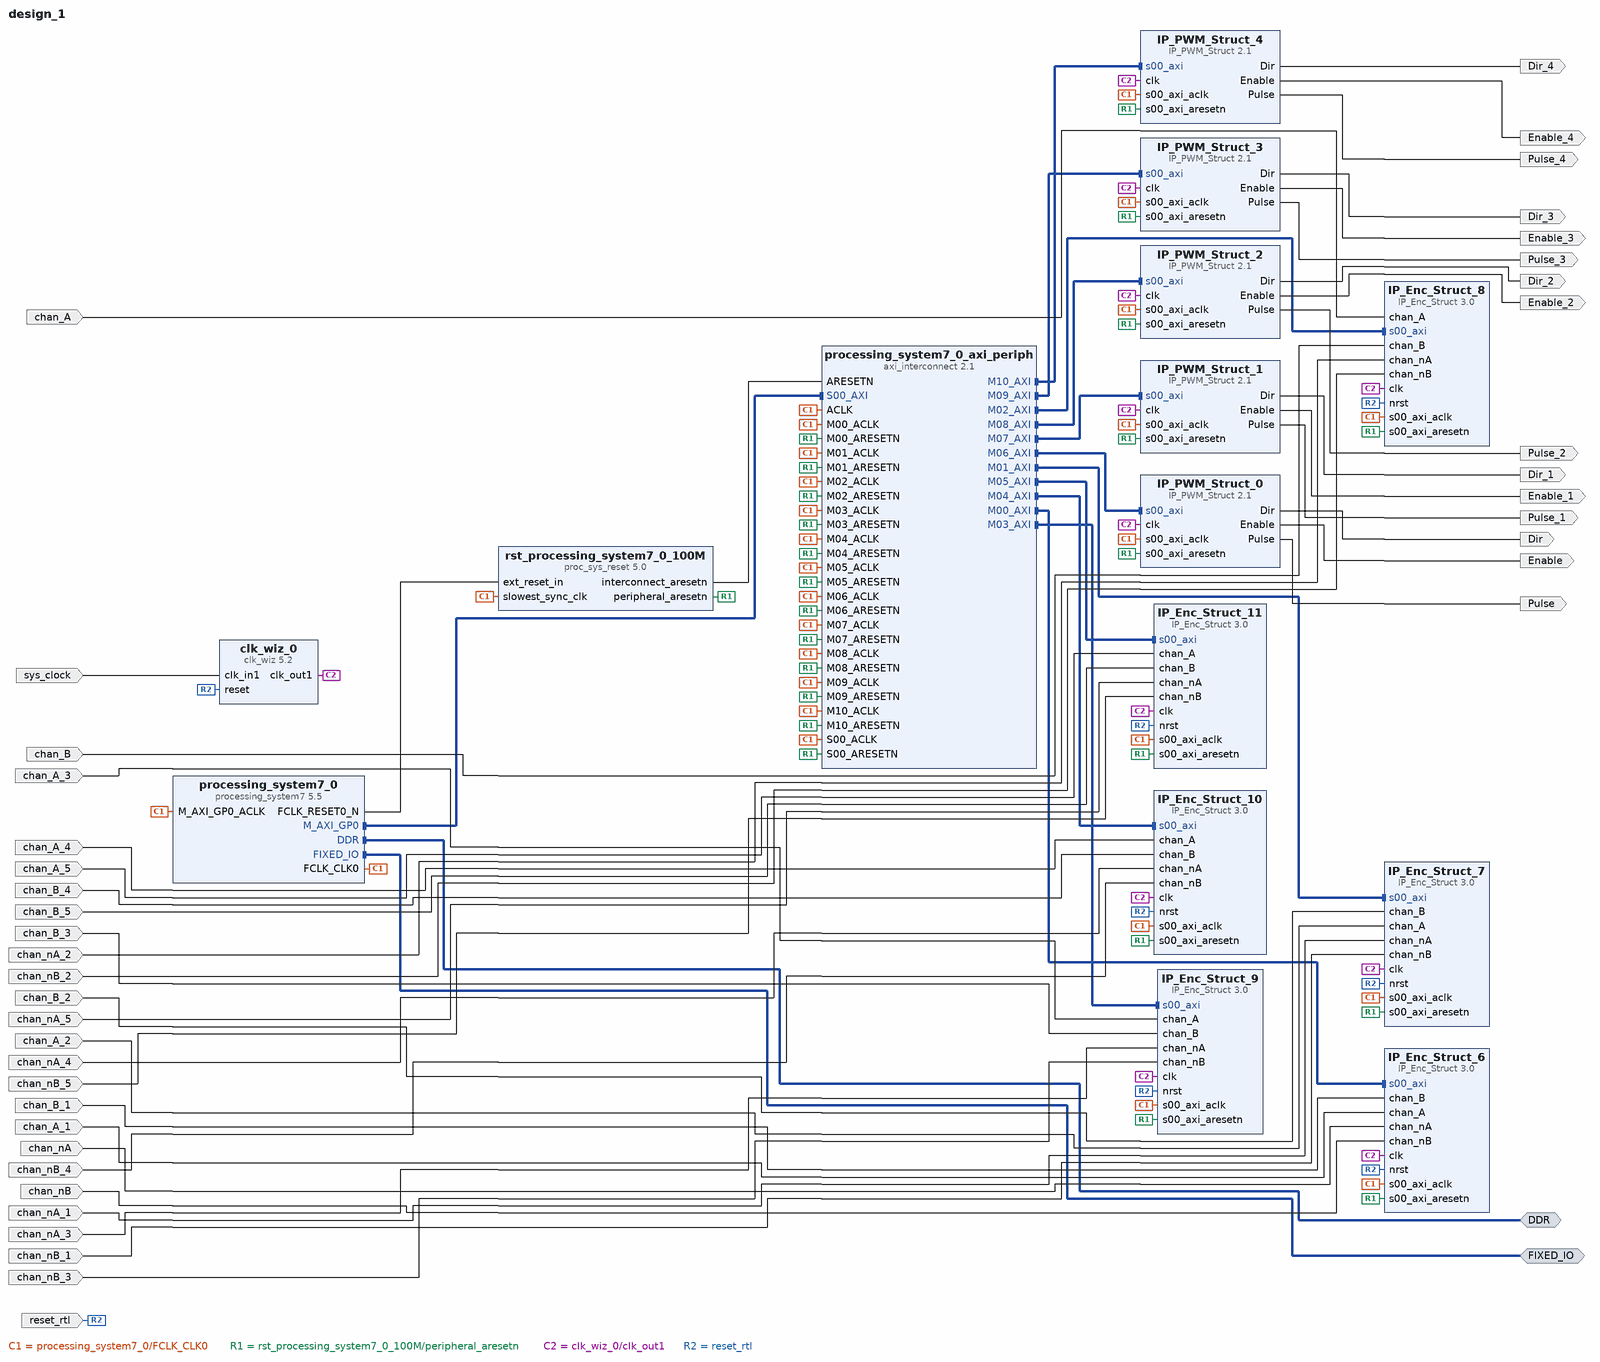
[diagram p0: block diagram of the top level]
# Vivado block design design_1, Vivado 2015.4
create_bd_design design_1

create_bd_intf_port -mode Master -vlnv xilinx.com:interface:ddrx_rtl:1.0 DDR
create_bd_intf_port -mode Master -vlnv xilinx.com:display_processing_system7:fixedio_rtl:1.0 FIXED_IO
create_bd_port -dir I -type clk sys_clock
set_property -dict {CONFIG.FREQ_HZ 125000000 CONFIG.PHASE 0.000} [get_bd_ports sys_clock]
create_bd_port -dir I -type rst reset_rtl
set_property -dict {CONFIG.POLARITY ACTIVE_HIGH} [get_bd_ports reset_rtl]
create_bd_port -dir I chan_A
create_bd_port -dir I chan_B
create_bd_port -dir I chan_A_3
create_bd_port -dir I chan_B_3
create_bd_port -dir I chan_B_2
create_bd_port -dir I chan_A_2
create_bd_port -dir I chan_B_1
create_bd_port -dir I chan_A_1
create_bd_port -dir I chan_A_4
create_bd_port -dir I chan_B_4
create_bd_port -dir I chan_A_5
create_bd_port -dir I chan_B_5
create_bd_port -dir O Pulse
create_bd_port -dir O Pulse_1
create_bd_port -dir O Pulse_2
create_bd_port -dir O Pulse_3
create_bd_port -dir O Pulse_4
create_bd_port -dir I chan_nA
create_bd_port -dir I chan_nB
create_bd_port -dir I chan_nA_1
create_bd_port -dir I chan_nB_1
create_bd_port -dir I chan_nA_2
create_bd_port -dir I chan_nB_2
create_bd_port -dir I chan_nA_3
create_bd_port -dir I chan_nB_3
create_bd_port -dir I chan_nA_4
create_bd_port -dir I chan_nB_4
create_bd_port -dir I chan_nA_5
create_bd_port -dir I chan_nB_5
create_bd_port -dir O Dir
create_bd_port -dir O Enable
create_bd_port -dir O Dir_1
create_bd_port -dir O Enable_1
create_bd_port -dir O Dir_2
create_bd_port -dir O Enable_2
create_bd_port -dir O Dir_3
create_bd_port -dir O Enable_3
create_bd_port -dir O Dir_4
create_bd_port -dir O Enable_4

create_bd_cell -type ip -vlnv xilinx.com:ip:processing_system7:5.5 processing_system7_0
set_property -dict [list \
  CONFIG.PCW_UIPARAM_DDR_FREQ_MHZ 525 \
  CONFIG.PCW_CRYSTAL_PERIPHERAL_FREQMHZ 50.000000 \
  CONFIG.PCW_APU_PERIPHERAL_FREQMHZ 650 \
  CONFIG.PCW_SDIO_PERIPHERAL_FREQMHZ 50 \
  CONFIG.PCW_FPGA0_PERIPHERAL_FREQMHZ 100 \
  CONFIG.PCW_FPGA1_PERIPHERAL_FREQMHZ 10 \
  CONFIG.PCW_PRESET_BANK1_VOLTAGE {LVCMOS 1.8V} \
  CONFIG.PCW_UIPARAM_DDR_PARTNO {MT41K128M16 JT-125} \
  CONFIG.PCW_QSPI_PERIPHERAL_ENABLE 1 \
  CONFIG.PCW_QSPI_GRP_SINGLE_SS_ENABLE 1 \
  CONFIG.PCW_QSPI_GRP_FBCLK_ENABLE 1 \
  CONFIG.PCW_ENET0_PERIPHERAL_ENABLE 1 \
  CONFIG.PCW_ENET0_ENET0_IO {MIO 16 .. 27} \
  CONFIG.PCW_ENET0_GRP_MDIO_ENABLE 1 \
  CONFIG.PCW_ENET0_RESET_ENABLE 0 \
  CONFIG.PCW_SD0_PERIPHERAL_ENABLE 1 \
  CONFIG.PCW_SD0_GRP_CD_ENABLE 1 \
  CONFIG.PCW_SD0_GRP_CD_IO {MIO 47} \
  CONFIG.PCW_SD0_GRP_WP_ENABLE 1 \
  CONFIG.PCW_UART1_PERIPHERAL_ENABLE 1 \
  CONFIG.PCW_SPI1_PERIPHERAL_ENABLE 1 \
  CONFIG.PCW_SPI1_SPI1_IO {MIO 10 .. 15} \
  CONFIG.PCW_SPI1_GRP_SS1_ENABLE 1 \
  CONFIG.PCW_SPI1_GRP_SS2_ENABLE 1 \
  CONFIG.PCW_TTC0_PERIPHERAL_ENABLE 1 \
  CONFIG.PCW_USB0_PERIPHERAL_ENABLE 1 \
  CONFIG.PCW_USB0_RESET_ENABLE 1 \
  CONFIG.PCW_USB0_RESET_IO {MIO 46} \
  CONFIG.PCW_GPIO_MIO_GPIO_ENABLE 1 \
] [get_bd_cells processing_system7_0]
# 108 more settings of processing_system7_0 are not shown: defaults, MIO pin electricals, DDR timing, and values the tool derives
create_bd_cell -type ip -vlnv xilinx.com:ip:axi_interconnect:2.1 processing_system7_0_axi_periph
set_property -dict {CONFIG.NUM_MI 11} [get_bd_cells processing_system7_0_axi_periph]
create_bd_cell -type ip -vlnv xilinx.com:ip:proc_sys_reset:5.0 rst_processing_system7_0_100M
create_bd_cell -type ip -vlnv xilinx.com:ip:clk_wiz:5.2 clk_wiz_0
set_property -dict [list \
  CONFIG.CLKOUT1_REQUESTED_OUT_FREQ 20.48 \
  CONFIG.MMCM_DIVCLK_DIVIDE 11 \
  CONFIG.MMCM_CLKFBOUT_MULT_F 60.375 \
  CONFIG.MMCM_CLKOUT0_DIVIDE_F 33.500 \
  CONFIG.USE_BOARD_FLOW true \
  CONFIG.CLK_IN1_BOARD_INTERFACE sys_clock \
  CONFIG.CLKOUT1_JITTER 638.166 \
  CONFIG.CLKOUT1_PHASE_ERROR 713.417 \
] [get_bd_cells clk_wiz_0]
create_bd_cell -type ip -vlnv xilinx.com:Fontys:IP_PWM_Struct:2.1 IP_PWM_Struct_0
create_bd_cell -type ip -vlnv xilinx.com:Fontys:IP_PWM_Struct:2.1 IP_PWM_Struct_1
create_bd_cell -type ip -vlnv xilinx.com:Fontys:IP_PWM_Struct:2.1 IP_PWM_Struct_2
create_bd_cell -type ip -vlnv xilinx.com:Fontys:IP_PWM_Struct:2.1 IP_PWM_Struct_3
create_bd_cell -type ip -vlnv xilinx.com:Fontys:IP_PWM_Struct:2.1 IP_PWM_Struct_4
create_bd_cell -type ip -vlnv xilinx.com:user:IP_Enc_Struct:3.0 IP_Enc_Struct_6
create_bd_cell -type ip -vlnv xilinx.com:user:IP_Enc_Struct:3.0 IP_Enc_Struct_7
create_bd_cell -type ip -vlnv xilinx.com:user:IP_Enc_Struct:3.0 IP_Enc_Struct_8
create_bd_cell -type ip -vlnv xilinx.com:user:IP_Enc_Struct:3.0 IP_Enc_Struct_9
create_bd_cell -type ip -vlnv xilinx.com:user:IP_Enc_Struct:3.0 IP_Enc_Struct_10
create_bd_cell -type ip -vlnv xilinx.com:user:IP_Enc_Struct:3.0 IP_Enc_Struct_11

# ---- connections ----

connect_bd_intf_net [get_bd_intf_pins processing_system7_0/M_AXI_GP0] [get_bd_intf_pins processing_system7_0_axi_periph/S00_AXI]
connect_bd_intf_net [get_bd_intf_pins processing_system7_0_axi_periph/M06_AXI] [get_bd_intf_pins IP_PWM_Struct_0/s00_axi]
connect_bd_intf_net [get_bd_intf_pins processing_system7_0_axi_periph/M07_AXI] [get_bd_intf_pins IP_PWM_Struct_1/s00_axi]
connect_bd_intf_net [get_bd_intf_pins processing_system7_0_axi_periph/M08_AXI] [get_bd_intf_pins IP_PWM_Struct_2/s00_axi]
connect_bd_intf_net [get_bd_intf_pins processing_system7_0_axi_periph/M09_AXI] [get_bd_intf_pins IP_PWM_Struct_3/s00_axi]
connect_bd_intf_net [get_bd_intf_pins processing_system7_0_axi_periph/M10_AXI] [get_bd_intf_pins IP_PWM_Struct_4/s00_axi]
connect_bd_intf_net [get_bd_intf_pins IP_Enc_Struct_11/s00_axi] [get_bd_intf_pins processing_system7_0_axi_periph/M05_AXI]
connect_bd_intf_net [get_bd_intf_pins IP_Enc_Struct_6/s00_axi] [get_bd_intf_pins processing_system7_0_axi_periph/M00_AXI]
connect_bd_intf_net [get_bd_intf_pins IP_Enc_Struct_7/s00_axi] [get_bd_intf_pins processing_system7_0_axi_periph/M01_AXI]
connect_bd_intf_net [get_bd_intf_pins IP_Enc_Struct_8/s00_axi] [get_bd_intf_pins processing_system7_0_axi_periph/M02_AXI]
connect_bd_intf_net [get_bd_intf_pins IP_Enc_Struct_9/s00_axi] [get_bd_intf_pins processing_system7_0_axi_periph/M03_AXI]
connect_bd_intf_net [get_bd_intf_pins IP_Enc_Struct_10/s00_axi] [get_bd_intf_pins processing_system7_0_axi_periph/M04_AXI]
connect_bd_intf_net [get_bd_intf_ports DDR] [get_bd_intf_pins processing_system7_0/DDR]
connect_bd_intf_net [get_bd_intf_ports FIXED_IO] [get_bd_intf_pins processing_system7_0/FIXED_IO]
connect_bd_net [get_bd_pins processing_system7_0/FCLK_CLK0] \
  [get_bd_pins processing_system7_0/M_AXI_GP0_ACLK] [get_bd_pins rst_processing_system7_0_100M/slowest_sync_clk] \
  [get_bd_pins IP_PWM_Struct_0/s00_axi_aclk] [get_bd_pins IP_PWM_Struct_1/s00_axi_aclk] \
  [get_bd_pins IP_PWM_Struct_2/s00_axi_aclk] [get_bd_pins IP_PWM_Struct_3/s00_axi_aclk] \
  [get_bd_pins IP_PWM_Struct_4/s00_axi_aclk] [get_bd_pins processing_system7_0_axi_periph/S00_ACLK] \
  [get_bd_pins processing_system7_0_axi_periph/ACLK] [get_bd_pins processing_system7_0_axi_periph/M00_ACLK] \
  [get_bd_pins processing_system7_0_axi_periph/M01_ACLK] [get_bd_pins processing_system7_0_axi_periph/M02_ACLK] \
  [get_bd_pins processing_system7_0_axi_periph/M03_ACLK] [get_bd_pins processing_system7_0_axi_periph/M04_ACLK] \
  [get_bd_pins processing_system7_0_axi_periph/M05_ACLK] [get_bd_pins processing_system7_0_axi_periph/M06_ACLK] \
  [get_bd_pins processing_system7_0_axi_periph/M07_ACLK] [get_bd_pins processing_system7_0_axi_periph/M08_ACLK] \
  [get_bd_pins processing_system7_0_axi_periph/M09_ACLK] [get_bd_pins processing_system7_0_axi_periph/M10_ACLK] \
  [get_bd_pins IP_Enc_Struct_6/s00_axi_aclk] [get_bd_pins IP_Enc_Struct_7/s00_axi_aclk] \
  [get_bd_pins IP_Enc_Struct_8/s00_axi_aclk] [get_bd_pins IP_Enc_Struct_9/s00_axi_aclk] \
  [get_bd_pins IP_Enc_Struct_10/s00_axi_aclk] [get_bd_pins IP_Enc_Struct_11/s00_axi_aclk]
connect_bd_net [get_bd_pins processing_system7_0/FCLK_RESET0_N] [get_bd_pins rst_processing_system7_0_100M/ext_reset_in]
connect_bd_net [get_bd_pins rst_processing_system7_0_100M/peripheral_aresetn] \
  [get_bd_pins IP_PWM_Struct_0/s00_axi_aresetn] [get_bd_pins IP_PWM_Struct_1/s00_axi_aresetn] \
  [get_bd_pins IP_PWM_Struct_2/s00_axi_aresetn] [get_bd_pins IP_PWM_Struct_3/s00_axi_aresetn] \
  [get_bd_pins IP_PWM_Struct_4/s00_axi_aresetn] [get_bd_pins processing_system7_0_axi_periph/S00_ARESETN] \
  [get_bd_pins processing_system7_0_axi_periph/M00_ARESETN] [get_bd_pins processing_system7_0_axi_periph/M01_ARESETN] \
  [get_bd_pins processing_system7_0_axi_periph/M02_ARESETN] [get_bd_pins processing_system7_0_axi_periph/M03_ARESETN] \
  [get_bd_pins processing_system7_0_axi_periph/M04_ARESETN] [get_bd_pins processing_system7_0_axi_periph/M05_ARESETN] \
  [get_bd_pins processing_system7_0_axi_periph/M06_ARESETN] [get_bd_pins processing_system7_0_axi_periph/M07_ARESETN] \
  [get_bd_pins processing_system7_0_axi_periph/M08_ARESETN] [get_bd_pins processing_system7_0_axi_periph/M09_ARESETN] \
  [get_bd_pins processing_system7_0_axi_periph/M10_ARESETN] [get_bd_pins IP_Enc_Struct_6/s00_axi_aresetn] \
  [get_bd_pins IP_Enc_Struct_7/s00_axi_aresetn] [get_bd_pins IP_Enc_Struct_8/s00_axi_aresetn] \
  [get_bd_pins IP_Enc_Struct_9/s00_axi_aresetn] [get_bd_pins IP_Enc_Struct_10/s00_axi_aresetn] \
  [get_bd_pins IP_Enc_Struct_11/s00_axi_aresetn]
connect_bd_net [get_bd_pins rst_processing_system7_0_100M/interconnect_aresetn] [get_bd_pins processing_system7_0_axi_periph/ARESETN]
connect_bd_net [get_bd_pins clk_wiz_0/clk_out1] \
  [get_bd_pins IP_PWM_Struct_0/clk] [get_bd_pins IP_PWM_Struct_1/clk] [get_bd_pins IP_PWM_Struct_2/clk] \
  [get_bd_pins IP_PWM_Struct_3/clk] [get_bd_pins IP_PWM_Struct_4/clk] [get_bd_pins IP_Enc_Struct_6/clk] \
  [get_bd_pins IP_Enc_Struct_7/clk] [get_bd_pins IP_Enc_Struct_8/clk] [get_bd_pins IP_Enc_Struct_9/clk] \
  [get_bd_pins IP_Enc_Struct_10/clk] [get_bd_pins IP_Enc_Struct_11/clk]
connect_bd_net [get_bd_ports sys_clock] [get_bd_pins clk_wiz_0/clk_in1]
connect_bd_net [get_bd_ports reset_rtl] \
  [get_bd_pins clk_wiz_0/reset] [get_bd_pins IP_Enc_Struct_6/nrst] [get_bd_pins IP_Enc_Struct_7/nrst] \
  [get_bd_pins IP_Enc_Struct_8/nrst] [get_bd_pins IP_Enc_Struct_9/nrst] [get_bd_pins IP_Enc_Struct_10/nrst] \
  [get_bd_pins IP_Enc_Struct_11/nrst]
connect_bd_net [get_bd_ports chan_A] [get_bd_pins IP_Enc_Struct_8/chan_A]
connect_bd_net [get_bd_ports chan_B] [get_bd_pins IP_Enc_Struct_8/chan_B]
connect_bd_net -net chan_A_3_1 [get_bd_ports chan_A_3] [get_bd_pins IP_Enc_Struct_9/chan_A]
connect_bd_net -net chan_B_3_1 [get_bd_ports chan_B_3] [get_bd_pins IP_Enc_Struct_9/chan_B]
connect_bd_net -net chan_B_2_1 [get_bd_ports chan_B_2] [get_bd_pins IP_Enc_Struct_7/chan_B]
connect_bd_net -net chan_A_2_1 [get_bd_ports chan_A_2] [get_bd_pins IP_Enc_Struct_7/chan_A]
connect_bd_net -net chan_B_1_1 [get_bd_ports chan_B_1] [get_bd_pins IP_Enc_Struct_6/chan_B]
connect_bd_net -net chan_A_1_1 [get_bd_ports chan_A_1] [get_bd_pins IP_Enc_Struct_6/chan_A]
connect_bd_net -net chan_A_4_1 [get_bd_ports chan_A_4] [get_bd_pins IP_Enc_Struct_10/chan_A]
connect_bd_net -net chan_B_4_1 [get_bd_ports chan_B_4] [get_bd_pins IP_Enc_Struct_10/chan_B]
connect_bd_net -net chan_A_5_1 [get_bd_ports chan_A_5] [get_bd_pins IP_Enc_Struct_11/chan_A]
connect_bd_net -net chan_B_5_1 [get_bd_ports chan_B_5] [get_bd_pins IP_Enc_Struct_11/chan_B]
connect_bd_net [get_bd_pins IP_PWM_Struct_0/Pulse] [get_bd_ports Pulse]
connect_bd_net [get_bd_pins IP_PWM_Struct_1/Pulse] [get_bd_ports Pulse_1]
connect_bd_net [get_bd_pins IP_PWM_Struct_2/Pulse] [get_bd_ports Pulse_2]
connect_bd_net [get_bd_pins IP_PWM_Struct_3/Pulse] [get_bd_ports Pulse_3]
connect_bd_net [get_bd_pins IP_PWM_Struct_4/Pulse] [get_bd_ports Pulse_4]
connect_bd_net [get_bd_ports chan_nA] [get_bd_pins IP_Enc_Struct_6/chan_nA]
connect_bd_net [get_bd_ports chan_nB] [get_bd_pins IP_Enc_Struct_6/chan_nB]
connect_bd_net -net chan_nA_1_1 [get_bd_ports chan_nA_1] [get_bd_pins IP_Enc_Struct_7/chan_nA]
connect_bd_net -net chan_nB_1_1 [get_bd_ports chan_nB_1] [get_bd_pins IP_Enc_Struct_7/chan_nB]
connect_bd_net -net chan_nA_2_1 [get_bd_ports chan_nA_2] [get_bd_pins IP_Enc_Struct_8/chan_nA]
connect_bd_net -net chan_nB_2_1 [get_bd_ports chan_nB_2] [get_bd_pins IP_Enc_Struct_8/chan_nB]
connect_bd_net -net chan_nA_3_1 [get_bd_ports chan_nA_3] [get_bd_pins IP_Enc_Struct_9/chan_nA]
connect_bd_net -net chan_nB_3_1 [get_bd_ports chan_nB_3] [get_bd_pins IP_Enc_Struct_9/chan_nB]
connect_bd_net -net chan_nA_4_1 [get_bd_ports chan_nA_4] [get_bd_pins IP_Enc_Struct_10/chan_nA]
connect_bd_net -net chan_nB_4_1 [get_bd_ports chan_nB_4] [get_bd_pins IP_Enc_Struct_10/chan_nB]
connect_bd_net -net chan_nA_5_1 [get_bd_ports chan_nA_5] [get_bd_pins IP_Enc_Struct_11/chan_nA]
connect_bd_net -net chan_nB_5_1 [get_bd_ports chan_nB_5] [get_bd_pins IP_Enc_Struct_11/chan_nB]
connect_bd_net [get_bd_pins IP_PWM_Struct_0/Dir] [get_bd_ports Dir]
connect_bd_net [get_bd_pins IP_PWM_Struct_0/Enable] [get_bd_ports Enable]
connect_bd_net [get_bd_pins IP_PWM_Struct_1/Dir] [get_bd_ports Dir_1]
connect_bd_net [get_bd_pins IP_PWM_Struct_1/Enable] [get_bd_ports Enable_1]
connect_bd_net [get_bd_pins IP_PWM_Struct_2/Dir] [get_bd_ports Dir_2]
connect_bd_net [get_bd_pins IP_PWM_Struct_2/Enable] [get_bd_ports Enable_2]
connect_bd_net [get_bd_pins IP_PWM_Struct_3/Dir] [get_bd_ports Dir_3]
connect_bd_net [get_bd_pins IP_PWM_Struct_3/Enable] [get_bd_ports Enable_3]
connect_bd_net [get_bd_pins IP_PWM_Struct_4/Dir] [get_bd_ports Dir_4]
connect_bd_net [get_bd_pins IP_PWM_Struct_4/Enable] [get_bd_ports Enable_4]

# ---- address map ----
assign_bd_address -offset 0x43C00000 -range 64K -target_address_space [get_bd_addr_spaces processing_system7_0/Data] [get_bd_addr_segs IP_Enc_Struct_10/s00_axi/reg0]
assign_bd_address -offset 0x43C10000 -range 64K -target_address_space [get_bd_addr_spaces processing_system7_0/Data] [get_bd_addr_segs IP_Enc_Struct_11/s00_axi/reg0]
assign_bd_address -offset 0x43C20000 -range 64K -target_address_space [get_bd_addr_spaces processing_system7_0/Data] [get_bd_addr_segs IP_Enc_Struct_6/s00_axi/reg0]
assign_bd_address -offset 0x43C30000 -range 64K -target_address_space [get_bd_addr_spaces processing_system7_0/Data] [get_bd_addr_segs IP_Enc_Struct_7/s00_axi/reg0]
assign_bd_address -offset 0x43C40000 -range 64K -target_address_space [get_bd_addr_spaces processing_system7_0/Data] [get_bd_addr_segs IP_Enc_Struct_8/s00_axi/reg0]
assign_bd_address -offset 0x43C50000 -range 64K -target_address_space [get_bd_addr_spaces processing_system7_0/Data] [get_bd_addr_segs IP_Enc_Struct_9/s00_axi/reg0]
assign_bd_address -offset 0x43C60000 -range 64K -target_address_space [get_bd_addr_spaces processing_system7_0/Data] [get_bd_addr_segs IP_PWM_Struct_0/s00_axi/reg0]
assign_bd_address -offset 0x43C70000 -range 64K -target_address_space [get_bd_addr_spaces processing_system7_0/Data] [get_bd_addr_segs IP_PWM_Struct_1/s00_axi/reg0]
assign_bd_address -offset 0x43C80000 -range 64K -target_address_space [get_bd_addr_spaces processing_system7_0/Data] [get_bd_addr_segs IP_PWM_Struct_2/s00_axi/reg0]
assign_bd_address -offset 0x43C90000 -range 64K -target_address_space [get_bd_addr_spaces processing_system7_0/Data] [get_bd_addr_segs IP_PWM_Struct_3/s00_axi/reg0]
assign_bd_address -offset 0x43CA0000 -range 64K -target_address_space [get_bd_addr_spaces processing_system7_0/Data] [get_bd_addr_segs IP_PWM_Struct_4/s00_axi/reg0]

validate_bd_design
save_bd_design
